# Altium schematic sheet Power_Supply.SchDoc
size A4; CompanyName: WEITI ISE; Address1: ul. Nowowiejska 15/19; Address2: 00-665 Warszawa; DocumentNumber: 7; SheetNumber: 7; SheetTotal: 11
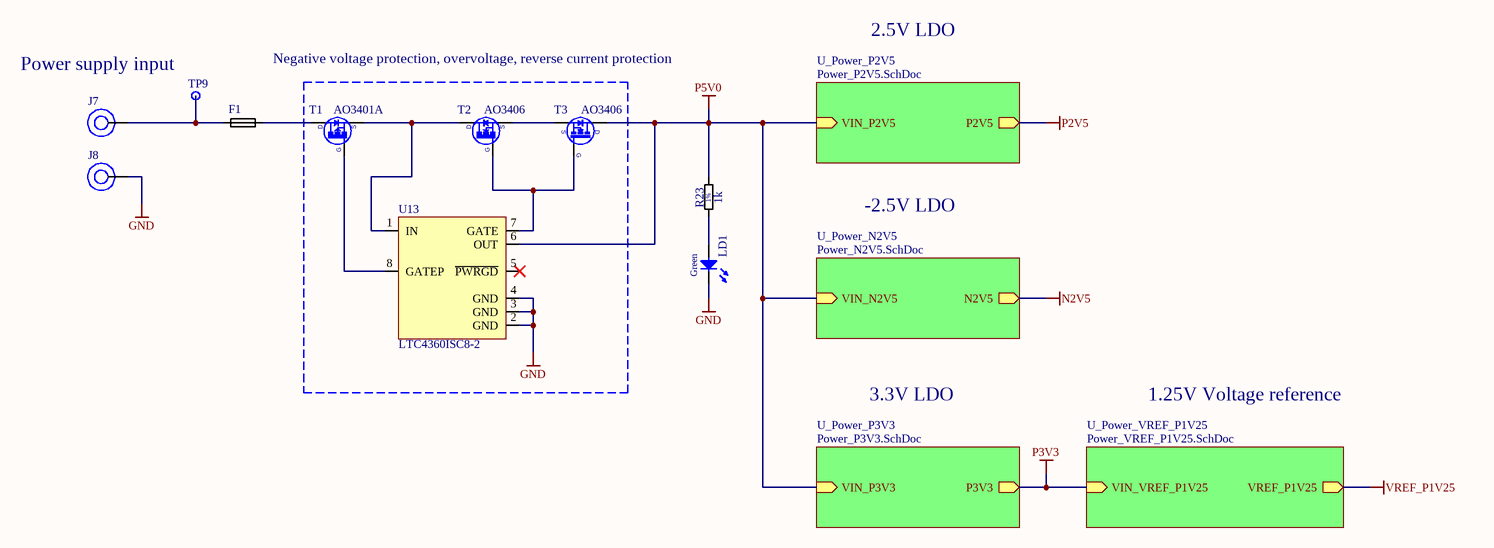
[diagram p0: Power_Supply.SchDoc]

## Parts
F1  C1Q 1.5  [FUSE1206]  (value not drawn)
J7  571-0500  [5710500-Deltron]  (value not drawn)
J8  571-0100  [5710100-Deltron]  (value not drawn)
LD1  Green  [LED_0603X60N]
R23  1k  [RESC0603X60N]
T1  AO3401A  [SOT23-3]
T2  AO3406  [SOT23-3]
T3  AO3406  [SOT23-3]
TP9  TestPoint  [TESTPOINT_SMD_C1P27MM]  (value not drawn)  (no BOM)
U13  LTC4360ISC8-2  [SC70-8]

## Sub-sheets
U_Power_N2V5 = Power_N2V5.SchDoc: N2V5 (out), VIN_N2V5 (in)
U_Power_P2V5 = Power_P2V5.SchDoc: P2V5 (out), VIN_P2V5 (in)
U_Power_P3V3 = Power_P3V3.SchDoc: P3V3 (out), VIN_P3V3 (in)
U_Power_VREF_P1V25 = Power_VREF_P1V25.SchDoc: VREF_P1V25 (out), VIN_VREF_P1V25 (in)

## Nets
GND: J8.1 LD1.1(C) U13.2(GND) U13.3(GND) U13.4(GND)
N2V5: sheet U_Power_N2V5/N2V5
P2V5: sheet U_Power_P2V5/P2V5
P3V3: sheet U_Power_P3V3/P3V3, sheet U_Power_VREF_P1V25/VIN_VREF_P1V25
P5V0: R23.2 T3.3(D) U13.6(OUT) ; sheet U_Power_P2V5/VIN_P2V5, sheet U_Power_N2V5/VIN_N2V5, sheet U_Power_P3V3/VIN_P3V3
VREF_P1V25: sheet U_Power_VREF_P1V25/VREF_P1V25
NetF1_1: F1.1 J7.1 TP9.1
NetF1_2: F1.2 T1.3(D)
NetLD1_2: LD1.2(A) R23.1
NetT1_1: T1.1(G) U13.8(GATEP)
NetT1_2: T1.2(S) T2.3(D) U13.1(IN)
NetT2_1: T2.1(G) T3.1(G) U13.7(GATE)
NetT2_2: T2.2(S) T3.2(S)

Not connected (* = marked no-connect by the designer): U13 5(~{PWRGD})*

## Notes on the sheet
- 2.5V LDO
- (near TP9) Power supply input
- Negative voltage protection, overvoltage, reverse current protection
- -2.5V LDO
- 3.3V LDO
- 1.25V Voltage reference
- Project:
- Title
- File:
- Drawn by:
- Engineer:
- Checked by:
- Szymon Jedliński
- Sheet:
- Revision:
- Total Sheet:
- 1.0
- Variant:
- Approved by:
- Date:

## Library data of the parts
F1 = C1Q 1: Fuse; Very Fast Acting; 1.5A; 125VAC, 63VDC; SMD;; Manufacturer 1 Component Height: 0.58mm; Voltage_rating: 125VAC/63VDC; Fuse type: Ceramic; Breaking capacity: 50A; Current_rating: 1.5A; DesignItemId: C1Q 1; Device: C1Q 1.5; HelpURL: https://www.mouser.pl/datasheet/2/643/ds-CP-c1q-series-1313102.pdf; Manufacturer Part Number: C1Q 1.5; SMD: Yes
J7 = 571-0500: 4mm Jack 90deg PCB Mounted Insulated Socket Red; Manufacturer 1 Component Height: 12.4mm; DesignItemId: 571-0500; Footprint: 571-0500; HelpURL: https://www.mouser.pl/datasheet/2/458/deltron-571-0500-4mm-90deg-single-socket-data-372654.pdf; Manufacturer Part Number: 571-0500; SMD: No
J8 = 571-0100: 4mm Jack 90deg PCB Mounted Insulated Socket Black; Manufacturer 1 Component Height: 12.4mm; DesignItemId: 571-0100; Footprint: 571-0100; HelpURL: https://www.mouser.pl/datasheet/2/458/deltron-571-0500-4mm-90deg-single-socket-data-372654.pdf; Manufacturer Part Number: 571-0100; SMD: No
LD1 = LED_0603_V_GREEN: SMD mono-color Chip LED, Green, 0603; Manufacturer Part Number: HSME-C191; Manufacturer 1 Component Height: 0.6mm; DesignItemId: LED_0603_V_GREEN; Color: Green; HelpURL: https://www.tme.eu/Document/898384df4a59fb78dfee2d27c6573b7a/HSME-C191.pdf; SMD: Yes
R23 = R0603_1K_0.1W_100PPM: General Purpose Thick Film Chip Resistor; Manufacturer Part Number: CQ03SAF1001T5E; Manufacturer 1 Component Height: 0.5mm; Tolerance: 1%; Voltage: 75V; DesignItemId: R0603_1K_0.1W_100PPM; SMD: Yes; Value: 1k
T1 = AO3401A: 30V P-Channel MOSFET; Manufacturer 1 Component Height: 1.05mm; DesignItemId: AO3401A; Device: AO3401A; HelpURL: https://www.tme.eu/Document/d25b071532a0a1e329733a03427696ee/AO3401A-DTE.pdf; Manufacturer Part Number: AO3401A; SMD: Yes
T2 T3 = AO3406: Transistor: N-MOSFET; unipolar; 30V; 2.9A; 0.9W; SOT23; Manufacturer 1 Component Height: 1.05mm; DesignItemId: AO3406; Device: AO3406; HelpURL: https://www.tme.eu/Document/0f7dd37f1878b91445c27729186942d7/AO3406.pdf; Manufacturer Part Number: AO3406; SMD: Yes
TP9 = TESTPOINT_SMD_C1P27MM: 1.27mm diameter SMD Test Point Area; DesignItemId: TESTPOINT_SMD_C1P27MM; Family: TestPoint; Part Description: 1.27mm diameter SMD Test Point Area
U13 = LTC4360ISC8-2: Overvoltage Protection Controller, 2.5V to 5.5V Operation, Reverse Voltage Protection; Manufacturer Part Number: LTC4360ISC8-2#TRMPBF; Manufacturer 1 Component Height: 1mm; DesignItemId: LTC4360ISC8-2; Device: LTC4360ISC8-2; HelpURL: https://www.analog.com/media/en/technical-documentation/data-sheets/LTC4360-1-4360-2.pdf; SMD: Yes